# EasyEDA Pro project 电赛7_25.epro, schematic 主板.02 copy copy
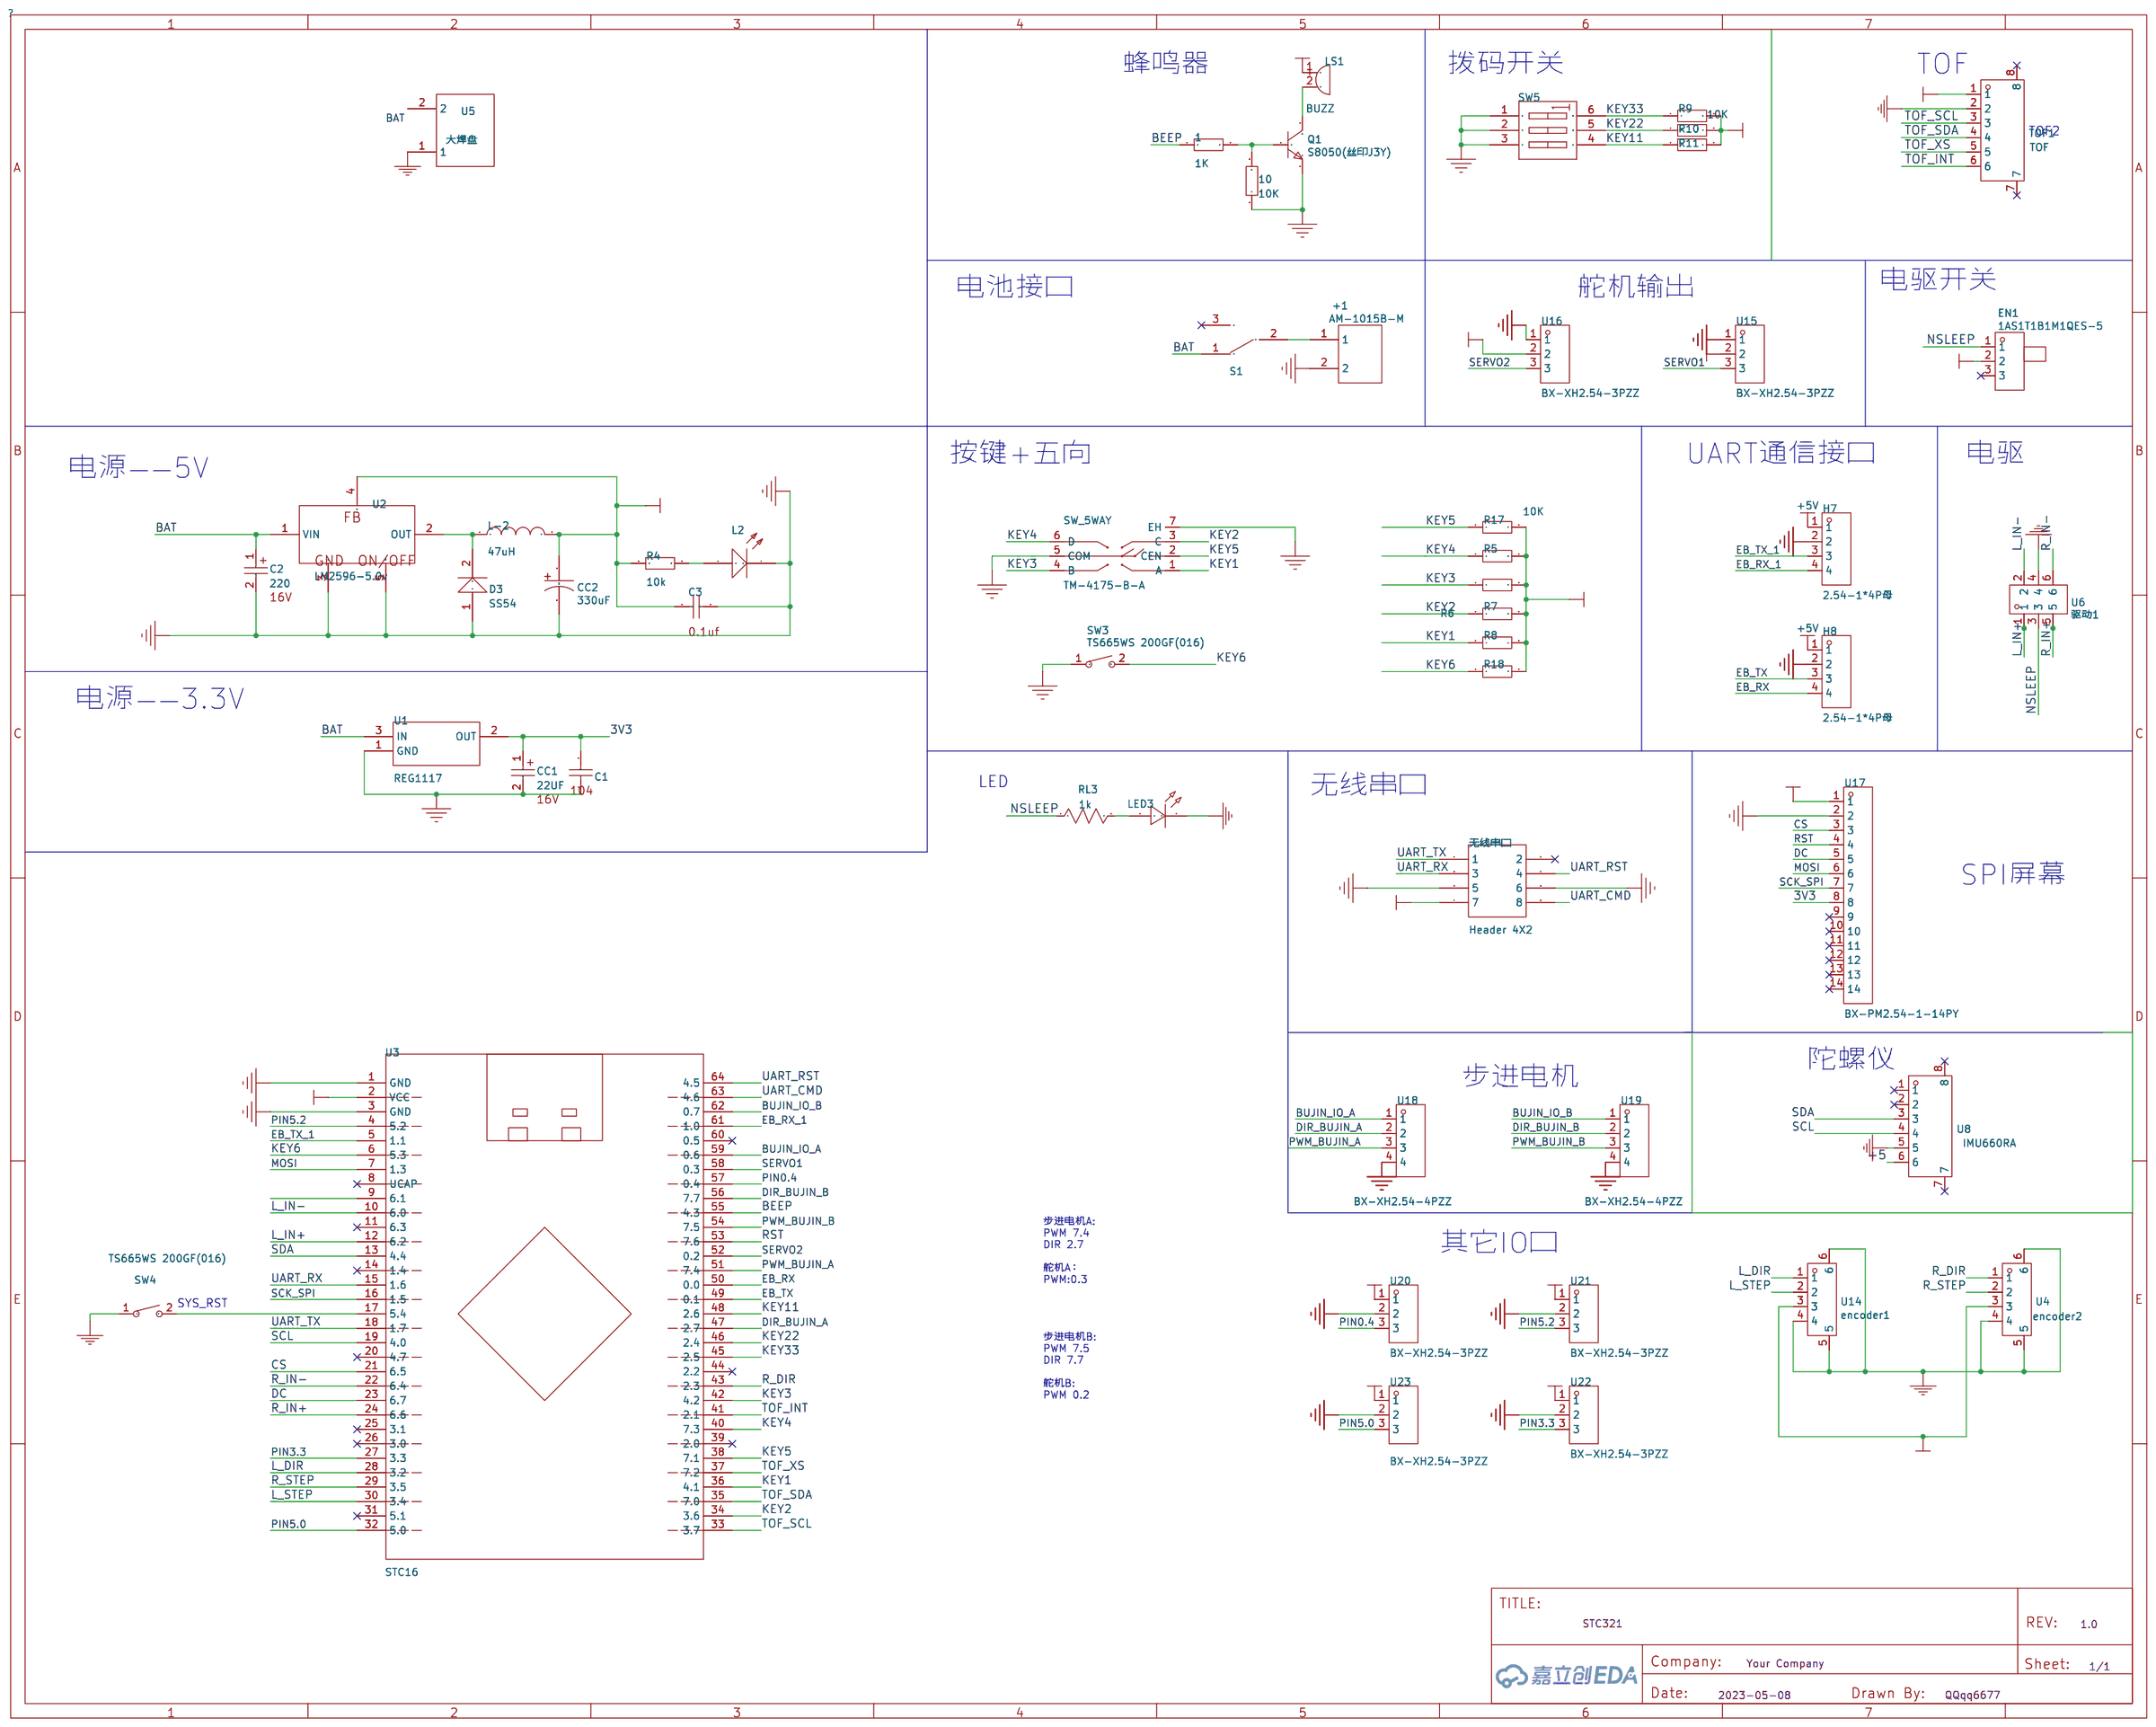
[diagram p0: schematic sheet]

## Parts
1  1K  [0603_R]
10  10K  [0603_R]
+1  AM-1015B-M  [CONN-TH_AM-1015B-M]
C1  104  [0603_C]
C2  220  [ED6.3]
C3  104  [0805_C]
CC1  22UF  [CASE-A_3216]
CC2  330uF  [CAP-TH_BD8.0-P3.50-D0.6-FD]
D3  SS54  [SMA(DO-214AC)_S1]
EN1  1AS1T1B1M1QES-5  [SW-TH_1AS1T1B1M1QES-5]
H7  2.54-1*4P母  [HDR-TH_4P-P2.54-V-F]
H8  2.54-1*4P母  [HDR-TH_4P-P2.54-V-F]
L2  绿灯 0603  [0603_LED_S1]
L-2  47uH  [7MMUH]
LED3  LED-0603_R  [LED0603_RED]
LS1  BUZZ  [BEEP]
Q1  S8050(丝印J3Y)  [S8050]
R4  10k  [0603_R]
R5  10K  [0603_R]
R6  10K  [0603_R]
R7  10K  [0603_R]
R8  10K  [0603_R]
R9  10K  [0603_R]
R10  10K  [0603_R]
R11  10K  [0603_R]
R17  10K  [0603_R]
R18  10K  [0603_R]
RL3  1k  [R0603]
S1  SS-12D10  [SS12D10]
SW3  TS665WS 200GF(016)  [SW-SMD_L6.0-W6.0-P6.00-LS6.6]
SW4  TS665WS 200GF(016)  [SW-SMD_L6.0-W6.0-P6.00-LS6.6]
SW5  DMR-03-T-V-T/R  [DMR-03]
SW_5WAY  TM-4175-B-A  [SW-SMD_TM-4175-B-X]
TOF1  TOF  [CONN-SMD_6P-P1.25_SHOU_1.25-6PWTDK]
U1  REG1117  [1117_SOT89]
U2  LM2596-5.0v  [LM2596S]
U3  STC16  [STC16]
U4  encoder2  [CONN-SMD_4P-P1.25_SHOUHAN_1.25-4PWTDK]
U5  大焊盘  [NEW_FOOTPRINT3]
U6  驱动1  [CONN-SMD_6P-P1.25_SHOU_1.25-6PWTDK]
U8  IMU660RA  [CONN-SMD_6P-P1.25_SHOU_1.25-6PWTDK]
U14  encoder1  [CONN-SMD_4P-P1.25_SHOUHAN_1.25-4PWTDK]
U15  BX-XH2.54-3PZZ  [CONN-TH_3P-P2.50_BX-XH2.54-3PZZ]
U16  BX-XH2.54-3PZZ  [CONN-TH_3P-P2.50_BX-XH2.54-3PZZ]
U17  BX-PM2.54-1-14PY  [HDR-TH_14P-P2.54-V-F-2]
U18  BX-XH2.54-4PZZ  [CONN-TH_4P-P2.50_BX-XH2.54-4PZZ]
U19  BX-XH2.54-4PZZ  [CONN-TH_4P-P2.50_BX-XH2.54-4PZZ]
U20  BX-XH2.54-3PZZ  [CONN-TH_3P-P2.50_BX-XH2.54-3PZZ]
U21  BX-XH2.54-3PZZ  [CONN-TH_3P-P2.50_BX-XH2.54-3PZZ]
U22  BX-XH2.54-3PZZ  [CONN-TH_3P-P2.50_BX-XH2.54-3PZZ]
U23  BX-XH2.54-3PZZ  [CONN-TH_3P-P2.50_BX-XH2.54-3PZZ]
无线串口  Header 4X2  [HDR2X4]

## Library data of the parts
1 = 1K: ComponentLink1Description: 供应商链接; ComponentLink1URL: http://www.szlcsc.com/product/details_21903.html; Supplier: LC; SuppliersPartNumber: C21189
10 R5-R11 R17 R18 = 10K: ComponentLink1Description: 供应商链接; ComponentLink1URL: http://www.szlcsc.com/product/details_21903.html; Supplier: LC; SuppliersPartNumber: C21189
+1 = AM-1015B-M: link: https://item.szlcsc.com/91818.html; Supplier: LCSC; Manufacturer: AMASS(艾迈斯); Supplier Part: C90631; JLCPCB Part Class: Extended Part
C1 = 104: 常见贴片电容尺寸图: https://wenku.baidu.com/view/21d5206100f69e3143323968011ca300a6c3f6b2.html
C2 = 220: Published: 8-Jun-2000; Revision: July-2002: Re-released for DXP Platform.; Publisher: Altium Limited; 查表选型: https://wenku.baidu.com/view/07eee7ff284ac850ad02428d.html?sxts=1527779080089; Voltage: 16V
C3 = 104: 常见贴片电容尺寸图: https://wenku.baidu.com/view/21d5206100f69e3143323968011ca300a6c3f6b2.html; Comment: 0.1uf
CC1 = 22UF: Published: 8-Jun-2000; Revision: July-2002: Re-released for DXP Platform.; Publisher: Altium Limited; 查表选型: https://wenku.baidu.com/view/634c510a26d3240c844769eae009581b6bd9bdf8.html; Voltage: 16V; Comment: Cap_Tan_3216
CC2 = 330uF: link: https://atta.szlcsc.com/upload/public/pdf/source/20151029/1457707523808.pdf; 3DModel: CAP-TH_D8.0-H8.0-P3.50; Supplier: LCSC; Supplier Part: C407891; Manufacturer: PANASONIC(松下); Manufacturer Part: EEUFR1E331; JLCPCB Part Class: Extended Part
D3 = SS54: ComponentLink1Description: 供应商链接; ComponentLink1URL: http://www.szlcsc.com/product/details_23178.html; Supplier: LC; SuppliersPartNumber: C22452
EN1 = 1AS1T1B1M1QES-5: link: https://item.szlcsc.com/507558.html?ref=editor&logined=true; 3DModel: SW-TH_L12.7-W6.6-H29.8-P4.7; Supplier: LCSC; Supplier Part: C496159; Manufacturer: Dailywell; JLCPCB Part Class: Extended Part
H7 H8 = 2.54-1*4P母: 插孔结构:1x4P;间距:2.54mm;行距:-;圆孔/方孔:方孔;安装类型:直插;排数:单排;总孔位数:4P;额定电流:3A;额定电压:-;插孔方向:顶部;塑高:-;触头材质:青铜;触头镀层:-;工作温度范围:-40℃~+105℃;焊接温度(最大值):-;; LCSC Part Name: 间距:2.54mm 1x4P 直插; Supplier Part: C2718488; Manufacturer: BOOMELE(博穆精密); Supplier Footprint: 插件,P=2.54mm; Datasheet: https://atta.szlcsc.com/upload/public/pdf/source/20210301/C2718488_F4427B881E42CAA8DDB0B1C12B3A522C.pdf; Supplier: LCSC; Holes Structure: 1x4P; Pitch: 2.54mm; Circular Hole / Square Hole: 方孔; Mounting Type: 直插; Number of Rows: 单排; Number of Holes: 4P; Current Rating (Max): 3A; Holes Direction: 顶部; Contact Material: 青铜; Operating Temperature Range: -40℃~+105℃
L2 = 绿灯 0603: ComponentLink1Description: 供应商链接; ComponentLink1URL: http://www.szlcsc.com/product/details_73152.html; Supplier: LC; SuppliersPartNumber: C72043
L-2 = 47uH: Published: 8-Jun-2000; LatestRevisionDate: 29-May-2009; LatestRevisionNote: IPC-7351 Footprint Added.; PackageReference: 0402-A; Publisher: Altium Limited; PackageDescription: Chip Inductor; Code_JEITA: 0402; Code_IEC: 1005
LED3 = LED-0603_R: 3DModel: LED0603_Red; Manufacturer: EVERLIGHT(台湾亿光); Manufacturer Part: 19-217/R6C-AL1M2VY/3T; Supplier Part: C72044; Supplier: LCSC
LS1 = BUZZ
Q1 = S8050(丝印J3Y): Supplier: LCSC; Supplier Part: C2931719; Manufacturer: Doeshare（德芯); link: https://atta.szlcsc.com//upload/public/pdf/source/20220117/E6D3315E0D6ADDB25840BFFAC039C5C0.pdf
R4 = 10k: ComponentLink1Description: 供应商链接; ComponentLink1URL: http://www.szlcsc.com/product/details_21903.html; Supplier: LC; SuppliersPartNumber: C21189
RL3 = 1k: link: https://www.mouser.in/datasheet/2/447/PYu_RT_1_to_0_01_RoHS_L_11-1669912.pdf
S1 = SS-12D10
SW3 SW4 = TS665WS 200GF(016): link: https://item.szlcsc.com/249857.html; 3DModel: SW-SMD_L6.0-W6.0-H5.0-P6.00-LS6.6; Supplier: LCSC; Supplier Part: C2858277; Manufacturer: SHOU HAN(首韩); Manufacturer Part: TS665WS 200gf(016); JLCPCB Part Class: Extended Part
SW5 = DMR-03-T-V-T/R: Supplier: LCSC; Supplier Part: C501558; Manufacturer: Diptronics; JLCPCB Part Class: Extended Part
SW_5WAY = TM-4175-B-A: Supplier: LCSC; Supplier Part: C465995; Manufacturer: XKB Connectivity(中国星坤); JLCPCB Part Class: Extended Part
TOF1 = TOF: link: https://atta.szlcsc.com/upload/public/pdf/source/20220427/C6A7BC561D300FF785E05A19B3C7AC5F.pdf; Supplier: LCSC; Supplier Part: C3008556; Manufacturer: SHOU HAN(首韩); Manufacturer Part: 1.25-6PWTDK
U1 = REG1117: Published: 8-Jun-2000; LatestRevisionDate: 17-Jul-2002; LatestRevisionNote: Re-released for DXP Platform.; DatasheetVersion: Sep-1997; PackageVersion: revC; PackageReference: ZZ311; Publisher: Altium Limited; PackageDescription: SOT-223/SC-73; 4 Leads; Body 6.7 x 7.3 mm, inc. leads (LxW max); ComponentLink1Description: Manufacturer Link; ComponentLink1URL: http://www.ti.com/; ComponentLink2Description: Datasheet; ComponentLink2URL: http://www-s.ti.com/sc/ds/REG1117.pdf
U2 = LM2596-5.0v
U3 = STC16
U4 = encoder2: link: https://atta.szlcsc.com/upload/public/pdf/source/20220427/006CB3E3578F619E540A50F8B0C3F638.pdf; Supplier: LCSC; Supplier Part: C3008554; Manufacturer: SHOU HAN(首韩); Manufacturer Part: 1.25-4PWTDK
U5 = 大焊盘
U6 = 驱动1: Supplier: LCSC; Supplier Part: C5157626; Manufacturer: kinghelm(金航标); Manufacturer Part: KH-2.54PH180-2X3P-L8.9; link: https://atta.szlcsc.com/upload/public/pdf/source/20220902/B59B6B538EA7651002CBD3760F447B01.pdf; JLCPCB Part Class: Extended Part
U8 = IMU660RA: link: https://atta.szlcsc.com/upload/public/pdf/source/20220427/C6A7BC561D300FF785E05A19B3C7AC5F.pdf; Supplier: LCSC; Supplier Part: C3008556; Manufacturer: SHOU HAN(首韩); Manufacturer Part: 1.25-6PWTDK
U14 = encoder1: link: https://atta.szlcsc.com/upload/public/pdf/source/20220427/006CB3E3578F619E540A50F8B0C3F638.pdf; Supplier: LCSC; Supplier Part: C3008554; Manufacturer: SHOU HAN(首韩); Manufacturer Part: 1.25-4PWTDK
U15 U16 U20-U23 = BX-XH2.54-3PZZ: 插针结构:1x3P;间距:2.54mm;安装方式:直插;参考系列:XH;总PIN数:3P;排数:1;每排PIN数:3;行距:-;额定电流:3A;触头材质:黄铜;触头镀层:锡;工作温度范围:-25℃~+85℃;; Supplier Part: C18077834; Manufacturer: Bossie(博锡); Supplier Footprint: 插件,P=2.54mm; Datasheet: https://atta.szlcsc.com/upload/public/pdf/source/20231017/BF89167887E1F965B2791D14EC788A09.pdf; Supplier: LCSC; Pins Structure: 1x3P; Pitch: 2.54mm; Mounting Style: 直插; Reference Series: XH; Number of Pins: 3P; Number of Rows: 1; Number of PINs Per Row: 3; Current Rating (Max): 3A; Contact Material: 黄铜; Contact Plating: 锡; Operating Temperature Range: -25℃~+85℃
U17 = BX-PM2.54-1-14PY: 插孔结构:1x14P;间距:2.54mm;行距:-;圆孔/方孔:方孔;安装类型:直插;排数:单排;总孔位数:14P;额定电流:3A;额定电压:1kV;插孔方向:顶部;塑高:8.5mm;触头材质:青铜;触头镀层:金;工作温度范围:-40℃~+105℃;焊接温度(最大值):260℃@5S;; LCSC Part Name: 间距:2.54mm 1x14P 直插; Supplier Part: C18078135; Manufacturer: Bossie(博锡); Supplier Footprint: 插件,P=2.54mm; Datasheet: https://atta.szlcsc.com/upload/public/pdf/source/20231017/9AC07A6AA061D7DD5ADD062F91FA1EC9.pdf; Supplier: LCSC; Holes Structure: 1x14P; Pitch: 2.54mm; Circular Hole / Square Hole: 方孔; Mounting Type: 直插; Number of Rows: 单排; Number of Holes: 14P; Current Rating (Max): 3A; Voltage Rating (Max): 1kV; Holes Direction: 顶部; Insulation Height: 8.5mm; Contact Material: 青铜; Contact Plating: 金; Operating Temperature Range: -40℃~+105℃; Soldering Temperature(Max): 260℃@5S
U18 U19 = BX-XH2.54-4PZZ: 插针结构:1x4P;间距:2.54mm;安装方式:直插;参考系列:XH;总PIN数:4P;排数:1;每排PIN数:4;行距:-;额定电流:3A;触头材质:黄铜;触头镀层:锡;工作温度范围:-25℃~+85℃;; Supplier Part: C18077835; Manufacturer: Bossie(博锡); Supplier Footprint: 插件,P=2.54mm; Datasheet: https://atta.szlcsc.com/upload/public/pdf/source/20231017/5821079C87ACB6AB664C681F6F628D03.pdf; Supplier: LCSC; Pins Structure: 1x4P; Pitch: 2.54mm; Mounting Style: 直插; Reference Series: XH; Number of Pins: 4P; Number of Rows: 1; Number of PINs Per Row: 4; Current Rating (Max): 3A; Contact Material: 黄铜; Contact Plating: 锡; Operating Temperature Range: -25℃~+85℃
无线串口 = Header 4X2: LatestRevisionDate: 17-Jul-2002; LatestRevisionNote: Re-released for DXP Platform.; Publisher: Altium Limited

## Nets
3V3: C1.2 CC1.1 U1.2(OUT) U17.8
+5V: H7.1 H8.1
GND: 10.1 +1.2 C1.1 C2.2 C3.2 CC1.2 CC2.2 D3.1(A) H7.2 H8.2 L2.K LED3.2 Q1.2(E) SW3.1 SW4.1 SW5.1(A1) SW5.2(A2) SW5.3(A3) SW_5WAY.5(COM) SW_5WAY.7(EH) TOF1.2 U1.1(GND) U2.3(GND) U2.5(ON/OFF) U3.1(GND) U3.3(GND) U4.4 U4.5 U4.6 U5.1 U6.4 U8.5 U14.4 U14.5 U14.6 U15.1 U16.1 U17.2 U18.4 U19.4 U20.2 U21.2 U22.2 U23.2 无线串口.5 无线串口.6
+5: C3.1 CC2.1 EN1.2 L-2.2 LS1.1 R4.1 R5.2 R6.2 R7.2 R8.2 R9.2 R10.2 R11.2 R17.2 R18.2 TOF1.1 U2.4(FB) U3.2(VCC) U4.3 U8.6 U14.3 U15.2 U16.2 U17.1 U20.1 U21.1 U22.1 U23.1 无线串口.7
BAT: C2.1 S1.1 U1.3(IN) U2.1(VIN) U5.2
BEEP: 1.1 U3.55(4.3)
BUJIN_IO_A: U3.59(0.6) U18.1
BUJIN_IO_B: U3.62(0.7) U19.1
CS: U3.21(6.5) U17.3
DC: U3.23(6.7) U17.5
DIR_BUJIN_A: U3.47(2.7) U18.2
DIR_BUJIN_B: U3.56(7.7) U19.2
EB_RX: H8.4 U3.50(0.0)
EB_RX_1: H7.4 U3.61(1.0)
EB_TX: H8.3 U3.49(0.1)
EB_TX_1: H7.3 U3.5(1.1)
KEY1: R8.1 SW_5WAY.1(A) U3.36(4.1)
KEY2: R7.1 SW_5WAY.3(C) U3.34(3.6)
KEY3: R6.1 SW_5WAY.4(B) U3.42(4.2)
KEY4: R5.1 SW_5WAY.6(D) U3.40(7.3)
KEY5: R17.1 SW_5WAY.2(CEN) U3.38(7.1)
KEY6: R18.1 SW3.2 U3.6(5.3)
KEY11: R11.1 SW5.4(A4) U3.48(2.6)
KEY22: R10.1 SW5.5(A5) U3.46(2.4)
KEY33: R9.1 SW5.6(A6) U3.45(2.5)
L_DIR: U3.28(3.2) U14.1
L_IN+: U3.12(6.2) U6.1
L_IN-: U3.10(6.0) U6.2
L_STEP: U3.30(3.4) U14.2
MOSI: U3.7(1.3) U17.6
NSLEEP: EN1.1 RL3.1 U6.3
PIN0.4: U3.57(0.4) U20.3
PIN3.3: U3.27(3.3) U22.3
PIN5.0: U3.32(5.0) U23.3
PIN5.2: U3.4(5.2) U21.3
PWM_BUJIN_A: U3.51(7.4) U18.3
PWM_BUJIN_B: U3.54(7.5) U19.3
R_DIR: U3.43(2.3) U4.1
R_IN+: U3.24(6.6) U6.5
R_IN-: U3.22(6.4) U6.6
R_STEP: U3.29(3.5) U4.2
RST: U3.53(7.6) U17.4
SCK_SPI: U3.16(1.5) U17.7
SCL: U3.19(4.0) U8.4
SDA: U3.13(4.4) U8.3
SERVO1: U3.58(0.3) U15.3
SERVO2: U3.52(0.2) U16.3
TOF_INT: TOF1.6 U3.41(2.1)
TOF_SCL: TOF1.3 U3.33(3.7)
TOF_SDA: TOF1.4 U3.35(7.0)
TOF_XS: TOF1.5 U3.37(7.2)
UART_CMD: U3.63(4.6) 无线串口.8
UART_RST: U3.64(4.5) 无线串口.4
UART_RX: U3.15(1.6) 无线串口.3
UART_TX: U3.18(1.7) 无线串口.1
$1N3: SW4.2 U3.17(5.4)
$1N24: D3.2(K) L-2.1 U2.2(OUT)
$1N55: LS1.2 Q1.3(C)
$1N83: L2.A R4.2
$1N88: 1.2 10.2 Q1.1(B)
$1N135: LED3.1 RL3.2
S1_2: +1.1 S1.2

Not connected (* = marked no-connect by the designer): EN1 3*; S1 3*; TOF1 7* 8*; U3 8(UCAP)* 9(6.1) 11(6.3)* 14(1.4)* 20(4.7)* 25(3.1)* 26(3.0)* 31(5.1)* 39(2.0)* 44(2.2)* 60(0.5)*; U8 1* 2* 7* 8*; U17 9* 10* 11* 12* 13* 14*; 无线串口 2*

## Notes on the sheet
- 蜂鸣器
- 拨码开关
- TOF
- TOF2
- 电驱开关
- 电池接口
- 舵机输出
- 电源——5V
- 按键+五向
- UART通信接口
- 电驱
- 电源——3.3V
- LED
- 无线串口
- SPI屏幕
- 陀螺仪
- 步进电机
- 其它IO口
- 步进电机A:
  PWM 7.4
  DIR 2.7
  舵机A：
  PWM:0.3
- SYS_RST
- 步进电机B:
  PWM 7.5
  DIR 7.7
  舵机B:
  PWM 0.2
